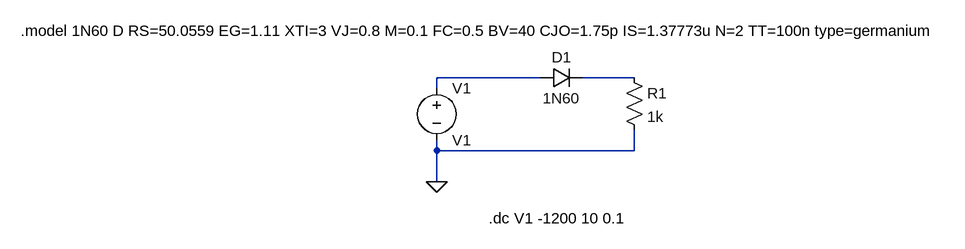
[diagram p0: schematic TP2 punto 1 GE inversa sim.asc]
TP2 punto 1 GE inversa sim.asc, the LTspice schematic file:
Version 4
SHEET 1 1000 680
WIRE 208 96 48 96
WIRE 352 96 272 96
WIRE 48 112 48 96
WIRE 48 208 48 192
WIRE 352 208 352 176
WIRE 352 208 48 208
WIRE 48 256 48 208
FLAG 48 256 0
SYMBOL res 336 80 R0
SYMATTR InstName R1
SYMATTR Value 1k
SYMBOL voltage 48 96 R0
SYMATTR InstName V1
SYMATTR Value V1
SYMBOL diode 208 112 R270
WINDOW 0 32 32 VTop 2
WINDOW 3 0 32 VBottom 2
SYMATTR InstName D1
SYMATTR Value 1N60
TEXT 128 312 Left 2 !.dc V1 -1200 10 0.1
TEXT -592 24 Left 2 !.model 1N60 D RS=50.0559 EG=1.11 XTI=3 VJ=0.8 M=0.1 FC=0.5 BV=40 CJO=1.75p IS=1.37773u N=2 TT=100n type=germanium

The netlist it stands for:
* TP2 punto 1 GE inversa sim.asc
R1 N002 0 1k
V1 N001 0 V1
D1 N001 N002 1N60
.model D D
.lib standard.dio
.dc V1 -1200 10 0.1
.model 1N60 D RS=50.0559 EG=1.11 XTI=3 VJ=0.8 M=0.1 FC=0.5 BV=40 CJO=1.75p IS=1.37773u N=2 TT=100n type=germanium
.backanno
.end